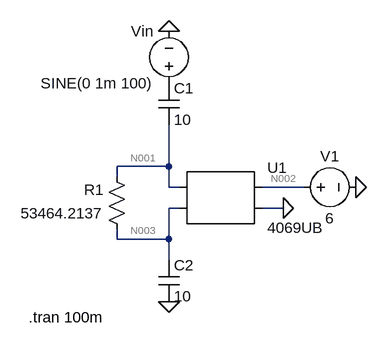
[diagram p0: schematic Q1.asc]
* Q1.asc
* U1: 4069UB (symbol AutoGenerated\4069UB not available, pins judged from their places): pin1=N001 pin2=N003 pin3=N002 pin4=0
R1 N003 N001 53464.2137
V1 N002 0 6
C1 P001 N001 10
C2 N003 0 10
Vin P001 0 SINE(0 1m 100)
.tran 100m
.backanno
.end

* Results of the author's LTspice run, read from the files saved beside the schematic
* Operating Point, zero values left out:
*   V(n003) = 2.563 V
*   V(n001) = 2.563 V
*   V(n002) = 6 V
*   I(C2) = 25.63 pA
*   I(C1) = -25.63 pA
*   I(R1) = 25.63 pA
*   I(Vin) = 25.63 pA
*   I(V1) = -252.3 µA
*   Ix(u1:VO) = -51.25 pA
*   Ix(u1:VDD) = 252.3 µA
*   Ix(u1:VSS) = -252.3 µA
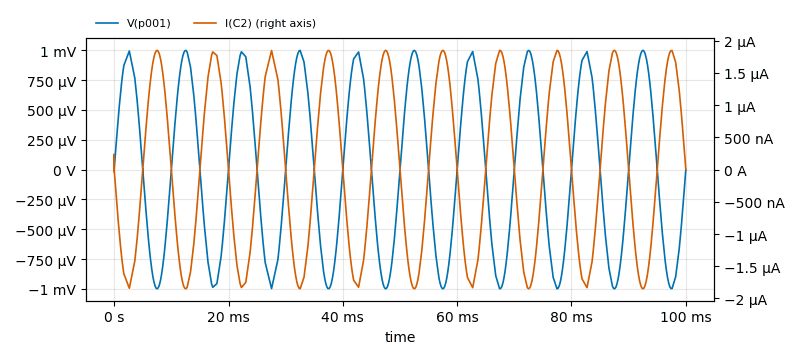
[diagram p1: Transient Analysis of Q1.asc, plotted from the saved traces]
* Transient Analysis, 1 run:
*   V(p001): min -999.8 µV, max 1 mV, average -688.4 nV, rms 703.6 µV, last 0 V
*   I(C2): min -1.85 µA, max 1.849 µA, average 1.263 nA, rms 1.302 µA, last 116.4 pA